# EAGLE design eagle (EAGLE 9.5.0)
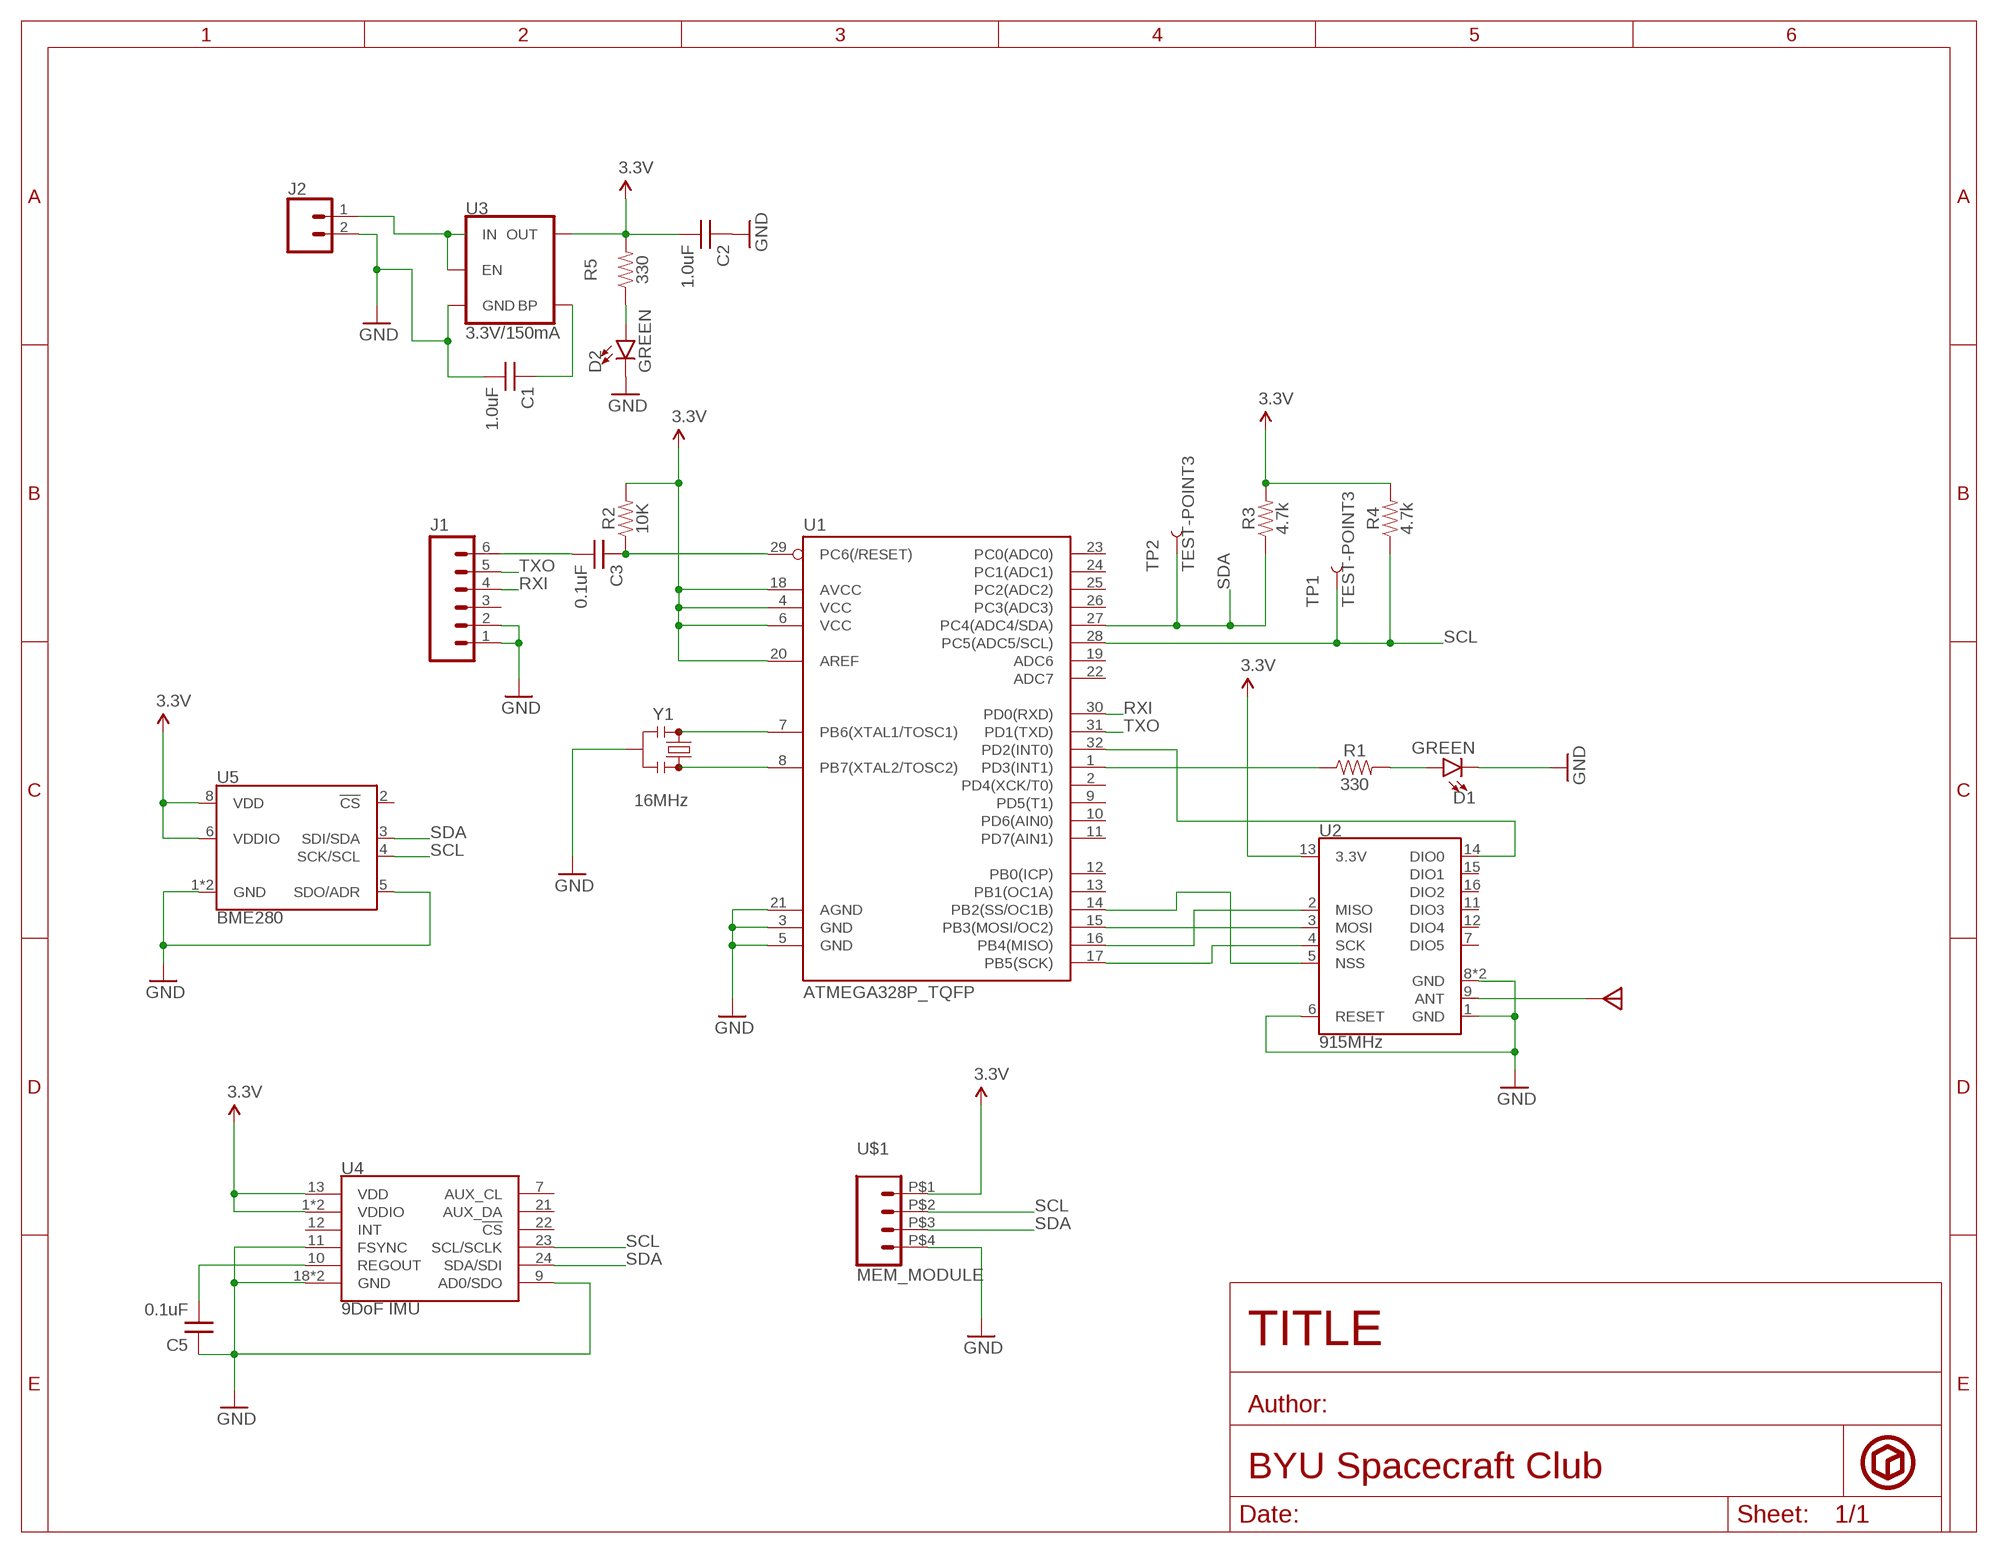
[diagram p0: schematic, sheet 1]

## Parts
ANT1  ANTENNA_PAD  [RFM12B-ANTENNA]
C1  1.0uF  CAPACITOR_1.0UF-0603-16V-10%  [0603]
C2  1.0uF  CAPACITOR_1.0UF-0603-16V-10%  [0603]
C3  0.1uF  CAPACITOR_0.1UF  [0603-CAP]
C5  0.1uF  CAPACITOR_0.1UF  [0603-CAP]
D1  GREEN  LED_GREEN0603  [LED-0603]
D2  GREEN  LED_GREEN0603  [LED-0603]
J1  CONNECTOR_6PINSILK_FEMALE_PTH  [1X06]
J2  CONNECTOR_2PIN-JST-2MM-SMT  [JST-2-SMD]
R1  330  RESISTOR_330OHM-0603-1/10W-1%  [0603]
R2  10K  RESISTOR_10KOHM0603  [0603-RES]
R3  4.7k  RESISTOR_4.7KOHM-0603-1/10W-1%  [0603]
R4  4.7k  RESISTOR_4.7KOHM-0603-1/10W-1%  [0603]
R5  330  RESISTOR_330OHM-0603-1/10W-1%  [0603]
TP1  TEST-POINT3  [PAD.03X.03]
TP2  TEST-POINT3  [PAD.03X.03]
U1  ATMEGA328P_TQFP  [TQFP32-08]
U2  915MHz  RADIO_RFM69HCW-915  [RFM69HCW-XXXS2]
U3  3.3V/150mA  VOLTAGE_REGULATOR_MIC52053.3V  [SOT23-5]
U4  9DoF IMU  MPU9250  [QFN24-3X3]
U5  BME280  [LGA-8-2.5X2.5]
U$1  MEM_MODULE  [MEM-HEADERS]
Y1  16MHz  RESONATOR_16MHZSMD_3.2X1.3  [RESONATOR-SMD-3.2X1.3]

## Nets
3.3V: C2.2 R2.2 R3.2 R4.2 R5.2 U1.4(VCC) U1.6(VCC) U1.18(AVCC) U1.20(AREF) U2.13(3.3V) U3.5(OUT) U4.1(VDDIO) U4.8(VDDIO) U4.13(VDD) U5.6(VDDIO) U5.8(VDD) U$1.P$1
GND: C1.2 C2.1 C5.1 D1.C D2.C J1.1 J1.2 J2.2 U1.3(GND) U1.5(GND) U1.21(AGND) U2.1(GND) U2.6(RESET) U2.8(GND) U2.10(GND) U3.2(GND) U4.9(AD0/SDO) U4.11(FSYNC) U4.18(GND) U4.20(GND) U5.1(GND) U5.5(SDO/ADR) U5.7(GND) U$1.P$4 Y1.2
INT: U1.32(PD2(INT0)) U2.14(DIO0)
N$1: U1.16(PB4(MISO)) U2.2(MISO)
N$2: U1.17(PB5(SCK)) U2.4(SCK)
N$3: U1.15(PB3(MOSI/OC2)) U2.3(MOSI)
N$4: J2.1 U3.1(IN) U3.3(EN)
N$5: ANT1.P$1 U2.9(ANT)
N$6: U1.14(PB2(SS/OC1B)) U2.5(NSS)
N$7: D2.A R5.1
N$9: C1.1 U3.4(BP)
N$10: U1.7(PB6(XTAL1/TOSC1)) Y1.1
N$11: U1.8(PB7(XTAL2/TOSC2)) Y1.3
N$12: D1.A R1.2
N$13: R1.1 U1.1(PD3(INT1))
N$14: C3.1 R2.1 U1.29(PC6(/RESET))
N$15: C3.2 J1.6
N$18: C5.2 U4.10(REGOUT)
RXI: J1.4 U1.30(PD0(RXD))
SCL: R4.1 TP1.P$1 U1.28(PC5(ADC5/SCL)) U4.23(SCL/SCLK) U5.4(SCK/SCL) U$1.P$2
SDA: R3.1 TP2.P$1 U1.27(PC4(ADC4/SDA)) U4.24(SDA/SDI) U5.3(SDI/SDA) U$1.P$3
TXO: J1.5 U1.31(PD1(TXD))
Unconnected: J1.3 U1.2(PD4(XCK/T0)) U1.9(PD5(T1)) U1.10(PD6(AIN0)) U1.11(PD7(AIN1)) U1.12(PB0(ICP)) U1.13(PB1(OC1A)) U1.19(ADC6) U1.22(ADC7) U1.23(PC0(ADC0)) U1.24(PC1(ADC1)) U1.25(PC2(ADC2)) U1.26(PC3(ADC3)) U2.7(DIO5) U2.11(DIO3) U2.12(DIO4) U2.15(DIO1) U2.16(DIO2) U4.7(AUX_CL) U4.12(INT) U4.21(AUX_DA) U4.22(!CS) U5.2(!CS)

## Library data of the parts
ANT1 = femtosat:ANTENNA_PAD: Pad for soldering on a wire antenna
C1 C2 = femtosat:CAPACITOR_1.0UF: 1µF ceramic capacitors A capacitor is a passive two-terminal electrical component used to store electrical energy temporarily in an electric field.; DIGIKEY: 399-3118-1-ND
C3 C5 = femtosat:CAPACITOR_0.1UF: CAP-00810 Ceramic Standard decoupling cap; DIGIKEY: 311-1343-1-ND
D1 D2 = femtosat:LED_GREEN: Green SMD LED Good as an indicator for power or to be controlled by a microcontroller Packages: 0603 - SMD 0603 package [Product Link] <https://www.digikey.com/product-detail/en/lite-on-inc/LTST-C190GKT/160-1183-1-ND/269255> Adapted fromt the SparkFun Libraries; DIGIKEY: 160-1183-1-ND
J1 = femtosat:CONNECTOR_6PIN: 6 pin connection point. Used on the femtosat for a programming connector. The ECEN shop stocks these regularly NOTES ON THE VARIANTS LOCK and LOCK_LONGPADS... This footprint was designed to help hold the alignment of a through-hole component (i.e. 6-pin header) while soldering it into place. You may notice that each hole has been shifted either up or down by 0.005 of an inch from it's more standard position (which is a perfectly straight line). This slight alteration caused the pins (the squares in the middle) to touch the edges of the holes. Because they are alternating, it causes a "brace" to hold the component in place. 0.005 has proven to be the perfect amount of "off-center" position when using our standard breakaway headers. Although looks a little odd when you look at the bare footprint, once you have a header in there, the alteration is very hard to notice. Also, if you push a header all the way into place, it is covered up entirely on the bottom side.
J2 = femtosat:CONNECTOR_2PIN: 2 pin connector 1X02 variant Can be used for soldering on wires or pins. JST-PTH variant is a through hole battery connector for SparkFun batteries JST-SMT variant is a surface mount battery connector for SparkFun batteries; DIGIKEY: 455-1749-1-ND
R1 R5 = femtosat:RESISTOR_330OHM: 330 Ohm resistor A resistor is a passive two-terminal electrical component that implements electrical resistance as a circuit element. Resistors act to reduce current flow, and, at the same time, act to lower voltage levels within circuits. - Wikipedia; DIGIKEY: 311-330GRCT-ND
R2 = femtosat:RESISTOR_10KOHM: 10k Ohm Resistor; DIGIKEY: 311-10KGRCT-ND
R3 R4 = femtosat:RESISTOR_4.7KOHM: 4.7k Ohm resistor A resistor is a passive two-terminal electrical component that implements electrical resistance as a circuit element. Resistors act to reduce current flow, and, at the same time, act to lower voltage levels within circuits. - Wikipedia; DIGIKEY: 311-4.7KGRCT-ND
TP1 TP2 = femtosat:TEST-POINT: Test Points Bare copper test points for troubleshooting or In-Circuit-Testing. These are used by our Production team for verifying production board runs using pogo-pins on test beds. Adapted from SparkFun Libraries
U1 = femtosat:ATMEGA328P_TQFP: ATMEGA 328P Microcontroller in QFP package Adapted from SparkFun libraries; DIGIKEY: ATMEGA328P-AURCT-ND
U2 = femtosat:RADIO_RFM69H: Hope RF RFM69H ISM Transceiver Module The RFM69H is a transceiver module capable of operation over a wide frequency range, including the 315,433,868 and 915MHz license-free ISM (Industry Scientific and Medical) frequency bands. All major RF communication parameters are programmable and most of them can be dynamically set. The RFM69H offers the unique advantage of programmable narrow-band and wide- band communication modes. The RFM69H is optimized for low power consumption while offering high RF output power and channelized operation.Compliance ETSI and FCC regulations. Datasheet <http://www.hoperf.cn/upload/docs/RF/SX/RFM69H_DataSheet_v1.3.pdf> Adapted from SparkFun Libraries; LINK: http://www.anarduino.com/details.jsp?pid=162
U3 = femtosat:VOLTAGE_REGULATOR_MIC5205: V_REG MIC5205 Standard 3.3V, 5V, and Adjustable 150mA LDO voltage regulator in SOT-23 layout. Micrel part MIC5205. BP (by-pass) pin is used to lower output noise with 470pF cap, may be left open. On the adjustable version BP is used to set output. Adapted from SparkFun Libraries; DIGIKEY: 576-1259-1-ND
U4 = femtosat:MPU9250: MPU-9250 9 Degree of Freedom IMU System in Package that contains MPU-6500 & AK8963 NC pin 19. 2-6 & 14-17 not internally connected. May be used for PCB trace routing. Datasheet <https://cdn.sparkfun.com/assets/learn_tutorials/5/5/0/MPU9250REV1.0.pdf> Adapted from SparkFun Libraries; DIGIKEY: 1428-1019-1-ND
U5 = femtosat:BME280: Bosch BME280 – Combined Humidity and Pressure Sensor The BME280 is as combined digital humidity, pressure and temperature sensor based on proven sensing principles. The sensor module is housed in an extremely compact metal-lid LGA package with a footprint of only 2.5×2.5mm² with a height of 0.93mm. Its small dimensions and its low power consumption allow the implementation in battery driven devices such as handsets, GPS modules or watches. Datasheet <https://cdn.sparkfun.com/assets/learn_tutorials/4/1/9/BST-BME280_DS001-10.pdf> Adapted from the SparkFun Libraries; DIGIKEY: 828-1063-1-ND
U$1 = femtosat:MEM_MODULE
Y1 = femtosat:RESONATOR_16MHZ: 16MHz Resonator Digikey Example <http://www.digikey.com/product-detail/en/murata-electronics-north-america/CSTCE16M0V53-R0/490-1198-1-ND/584635> Frequency: 16MHz Frequency Stability: ±0.3% Frequency Tolerance: ±0.5% Capacitance: 15pF Adapted from SparkFun Libraries; DIGIKEY: 490-1198-1-ND

## Board
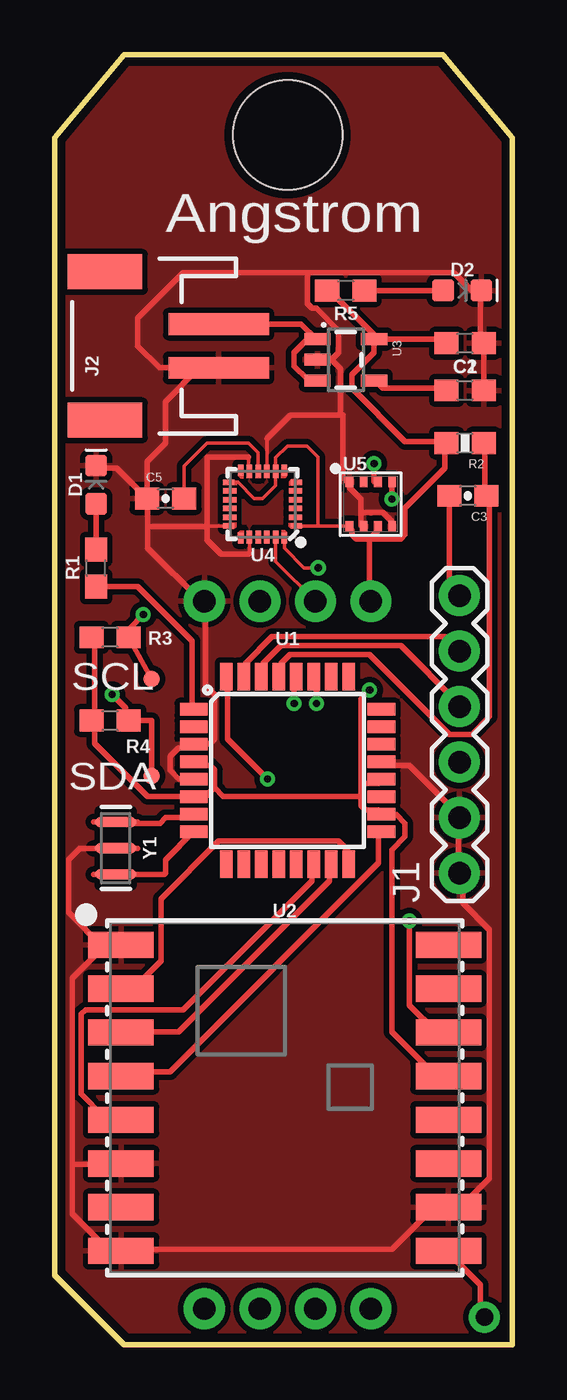
[diagram p1: board, top side]
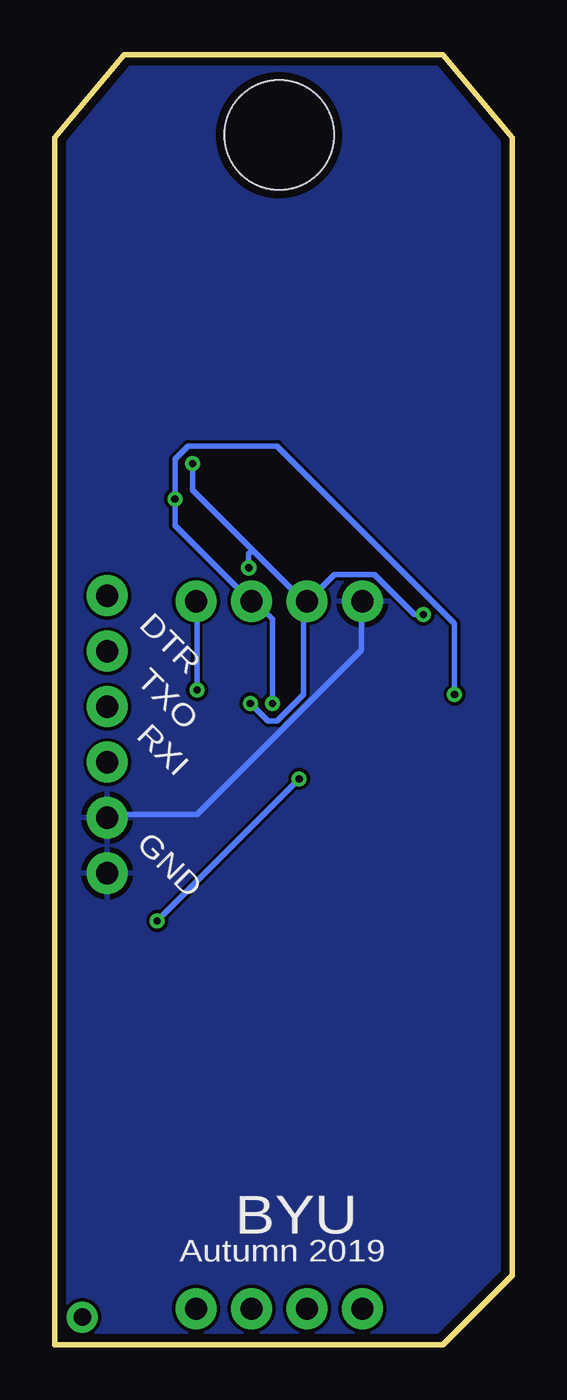
[diagram p2: board, bottom side, seen from below]

Size 20.95 x 59.05 mm. Coordinates in mm from the lower left corner, seen from the top.
Outline: 20.95,0 3.17,0 0,3.18 0,55.24 3.17,59.05 17.78,59.05 20.95,55.24 20.95,0
Copper layers (1*16): Top 0.0356mm / dielectric 1.5011mm / Bottom 0.0356mm
Design rules "femtosat *": minimum track width 10mil, minimum drill 13mil, track to track 6mil, track to pad 6mil, pad to pad 6mil, via to via 6mil, smd to smd 6mil, copper to edge 15mil, drill to drill 6mil, minimum pad ring 7mil, minimum via ring 7mil, stop-mask expansion 2.5mil, vias tented up to drill 0mil, thermal gap 10mil
Holes 5 mm at 10.67,55.37

### Footprints (pad centres in the part's own frame; a part is rotated, then mirrored left to right if it is on the bottom)
RFM12B-ANTENNA = drill 0.8 pad 1.422: P$1 0,0
0603 = smd 1.1 x 1: 1 -0.85,0; 2 0.85,0
0603-CAP = smd 1.1 x 1: 1 -0.85,0; 2 0.85,0
LED-0603 = smd 1 x 1: A -0.877,0; C 0.877,0
1X06 = drill 1.016 pad 1.88: 1 -6.35,0; 2 -3.81,0; 3 -1.27,0; 4 1.27,0; 5 3.81,0; 6 6.35,0
JST-2-SMD = smd 1 x 4.6: 1 1,-3.7; 2 -1,-3.7 | smd 1.6 x 3.4: NC1 -3.4,1.5; NC2 3.4,1.5
0603-RES = smd 1.1 x 1: 1 -0.85,0; 2 0.85,0
PAD.03X.03 = smd 0.762 x 0.762: P$1 0,0
TQFP32-08 = smd 1.27 x 0.559: 1 -4.293,2.8; 2 -4.293,2; 3 -4.293,1.2; 4 -4.293,0.4; 5 -4.293,-0.4; 6 -4.293,-1.2; 7 -4.293,-2; 8 -4.293,-2.8; 17 4.293,-2.8; 18 4.293,-2; 19 4.293,-1.2; 20 4.293,-0.4; 21 4.293,0.4; 22 4.293,1.2; 23 4.293,2; 24 4.293,2.8 | smd 0.559 x 1.27: 9 -2.8,-4.293; 10 -2,-4.293; 11 -1.2,-4.293; 12 -0.4,-4.293; 13 0.4,-4.293; 14 1.2,-4.293; 15 2,-4.293; 16 2.8,-4.293; 25 2.8,4.293; 26 2,4.293; 27 1.2,4.293; 28 0.4,4.293; 29 -0.4,4.293; 30 -1.2,4.293; 31 -2,4.293; 32 -2.8,4.293
RFM69HCW-XXXS2 = smd 3 x 1.2: 1 -7.5,7; 2 -7.5,5; 3 -7.5,3; 4 -7.5,1; 5 -7.5,-1; 6 -7.5,-3; 7 -7.5,-5; 8 -7.5,-7; 9 7.5,-7; 10 7.5,-5; 11 7.5,-3; 12 7.5,-1; 13 7.5,1; 14 7.5,3; 15 7.5,5; 16 7.5,7
SOT23-5 = smd 0.55 x 1.2: 1 -0.95,-1.3; 2 0,-1.3; 3 0.95,-1.3; 4 0.95,1.3; 5 -0.95,1.3
QFN24-3X3 = smd 0.495 x 0.25: 1 -1.552,1; 6 -1.552,-1; 13 1.552,-1; 18 1.552,1 | smd 0.6 x 0.25: 2 -1.5,0.6; 3 -1.5,0.2; 4 -1.5,-0.2; 5 -1.5,-0.6; 14 1.5,-0.6; 15 1.5,-0.2; 16 1.5,0.2; 17 1.5,0.6 | smd 0.25 x 0.495: 7 -1,-1.552; 12 1,-1.552; 19 1,1.552; 24 -1,1.552 | smd 0.25 x 0.6: 8 -0.6,-1.5; 9 -0.2,-1.5; 10 0.2,-1.5; 11 0.6,-1.5; 20 0.6,1.5; 21 0.2,1.5; 22 -0.2,1.5; 23 -0.6,1.5
LGA-8-2.5X2.5 = smd 0.35 x 0.5: 1 -0.975,1.025; 2 -0.325,1.025; 3 0.325,1.025; 4 0.975,1.025; 5 0.975,-1.025; 6 0.325,-1.025; 7 -0.325,-1.025; 8 -0.975,-1.025
MEM-HEADERS = drill 1.016 pad 1.88: P$1 0,0; P$2 2.54,0; P$3 5.08,0; P$4 7.62,0; P$5 0,32.385; P$6 2.54,32.385; P$7 5.08,32.385; P$8 7.62,32.385
RESONATOR-SMD-3.2X1.3 = smd 0.45 x 1.905: 1 -1.2,0; 2 0,0; 3 1.2,0

### Placement (x,y rotation side)
ANT1  19.68,1.27 0 top
C1  18.8,43.69 0 top
C2  18.8,45.85 180 top
C3  18.92,38.86 180 top
C5  5.08,38.73 0 top
D1  1.91,39.37 90 top
D2  18.67,48.26 0 top
J1  18.54,27.94 90 top
J2  3.81,45.72 90 top
R1  1.91,35.56 90 top
R2  18.8,41.28 180 top
R3  2.54,32.39 180 top
R4  2.54,28.57 180 top
R5  13.34,48.26 180 top
TP1  4.45,26.04 0 top
TP2  4.45,30.48 0 top
U1  10.67,26.29 0 top
U2  10.54,11.3 0 top
U3  13.34,45.08 270 top
U4  9.53,38.48 180 top
U5  14.48,38.48 0 top
U$1  14.48,34.04 180 top
Y1  2.79,22.73 270 top

### Tracks (layer width: path | path; a pad name or v marks a point on that pad's centre or on a via)
3.3V  (via drill 0.33)
  Top 0.152: U4.1 12.06,37.48 | 12.06,37.48 13.48,37.48 | U4.13 8.4,39.48 9.14,38.73 9.53,38.73 10.12,39.33 U4.8 10.12,40.61 10.67,41.15 11.56,41.15 12.06,40.64 12.06,37.48
  Top 0.254: R5.2 12.6,48.26 14.63,46.23 U3.5 | C2.2 17.88,46.03 14.83,46.03 U3.5 | 14.43,36.88 13.82,36.88 13.61,37.08 13.61,37.29 U5.8 13.48,37.48 | 14.43,36.88 14.83,37.29 U5.6 | 14.43,36.88 14.43,34.04 U$1.P$1 | 14.43,36.88 15.85,36.88 16.05,37.08 16.05,38.3 17.88,40.13 17.88,41.15 R2.2 17.88,41.35 16.05,41.35 13.61,43.79 13.61,44.4 14.63,45.42 U3.5 | 14.02,25.5 14.02,25.1 | 14.02,25.1 14.02,24.69 14.22,24.49 14.83,24.49 U1.18 15.04,24.28 15.65,24.28 16.05,23.88 16.05,23.27 15.44,22.66 15.44,14.33 17.27,12.5 17.88,12.5 U2.13 | 14.02,25.5 14.22,25.71 14.83,25.71 U1.20 | 7.32,25.5 6.91,25.1 6.5,25.1 U1.6 6.3,25.1 4.27,25.1 1.83,27.53 1.83,28.55 R4.2 1.83,28.75 1.83,32.21 R3.2 | 7.32,25.5 7.32,26.31 7.11,26.52 6.5,26.52 U1.4 | 14.02,25.1 7.72,25.1 7.32,25.5 | v14.43,29.97 14.02,29.57 14.02,25.5
  Bottom 0.254: v14.43,29.97 14.43,34.04 U$1.P$1
GND
  Top 0.152: U4.20 8.93,36.23 | U4.9 9.72,41.47 | U4.18 7,37.48 | U4.11 8.89,40.02 8.89,40.64
  Top 0.254: D1.C 2.03,40.13 2.85,40.13 4.06,38.91 C5.1 | U1.5 6.3,25.91 5.69,25.91 5.28,26.31 5.28,26.92 5.69,27.33 6.3,27.33 U1.3 6.5,27.53 7.11,27.53 7.32,27.74 7.32,29.77 6.91,30.18 6.91,34.04 U$1.P$4 6.71,34.04 4.27,36.47 4.27,37.47 | 4.27,37.47 4.27,38.71 C5.1 | 14.02,38.1 14.02,38.71 13.5,39.23 U5.1 13.41,39.52 13.21,39.73 13.21,42.55 13.08,42.55 | 14.02,38.1 14.02,37.49 U5.7 | 14.02,38.1 15.04,38.1 15.44,37.69 15.44,37.49 U5.5 | 19.51,48.26 19.51,46.03 C2.1 C1.2 | 19.51,48.26 19.1,48.26 18.29,49.07 11.58,49.07 | 11.58,49.07 5.89,49.07 3.81,46.99 3.81,45.72 4.81,44.72 J2.2 6.62,44.72 5.08,43.18 5.08,41.28 4.23,40.42 C5.1 | 19.51,48.26 D2.C | 11.58,49.07 11.58,47.65 11.79,47.45 11.99,47.45 13.01,46.43 13.01,45.42 12.68,45.08 | U1.21 15.04,26.52 16.26,26.52 18.49,24.28 J1.2 18.49,24.08 18.49,21.64 J1.1 18.69,21.44 18.69,20.22 19.91,19 19.91,7.62 18.69,6.4 18.09,6.4 U2.10 17.88,6.2 17.27,6.2 15.44,4.37 3.05,4.37 U2.8 2.85,4.37 2.44,4.37 0.81,5.99 0.81,8.25 | 2.23,18.19 2.85,18.19 U2.1 | 2.23,18.19 0.81,16.76 0.81,8.25 | 8.89,40.64 6.99,40.64 6.99,37.47 | 6.99,37.47 6.99,36.83 7.62,36.2 8.89,36.2 8.93,36.23 | Y1.2 1.14,22.73 0.64,22.22 0.64,19.79 2.23,18.19 | U2.6 2.99,8.25 0.81,8.25 | 9.72,41.47 10.79,42.55 13.08,42.55 | 12.68,45.08 U3.2 | 12.68,45.08 13.08,44.68 13.08,42.55 | 7,37.48 6.99,37.47 | 6.99,37.47 4.27,37.47
  Bottom 0.254: U$1.P$4 6.91,34.04 6.91,31.8 14.43,24.28 18.49,24.28 J1.2
  pour Top (isolate 0.254): 0,3.18 0,55.24 3.17,59.05 17.78,59.05 20.95,55.24 20.95,0 3.17,0
  pour Bottom: 3.17,59.05 0,55.24 0,3.18 3.17,0 20.95,0 20.95,55.24 17.78,59.05
INT  (via drill 0.33)
  Top 0.254: v9.75,25.91 7.92,27.74 7.92,30.58 U1.32 | v16.26,19.41 16.26,15.55 17.48,14.33 17.88,14.33 U2.14
  Bottom 0.254: v16.26,19.41 v9.75,25.91
N$1
  Top 0.254: U1.16 13.41,22.05 13.41,22.66 13.01,23.06 7.52,23.06 4.88,20.42 4.88,17.58 3.66,16.36 3.05,16.36 U2.2
N$2
  Top 0.254: U1.17 14.83,23.47 14.83,22.05 5.28,12.5 3.05,12.5 U2.4
N$3
  Top 0.254: U1.15 12.6,21.84 12.6,21.23 5.69,14.33 3.05,14.33 U2.3
N$4
  Top 0.254: 11.99,46.03 11.58,46.03 10.97,45.42 10.97,44.81 11.58,44.2 11.99,44.2 U3.3 | 11.99,46.03 U3.1 | J2.1 11.29,46.72 11.99,46.03
N$5
  Top 0.254: ANT1.P$1 19.51,1.32 19.51,2.74 18.09,4.17 U2.9
N$6
  Top 0.254: U1.14 11.79,21.84 11.79,21.23 5.89,15.34 1.42,15.34 1.22,15.14 1.22,11.48 2.23,10.46 2.85,10.46 U2.5
N$7
  Top 0.254: R5.1 D2.A
N$9
  Top 0.254: C1.1 17.88,43.79 15.04,43.79 14.83,43.99 U3.4
N$10
  Top 0.254: U1.7 6.22,24.13 5.08,24.13 4.83,23.88 2.85,23.88 Y1.1
N$11
  Top 0.254: U1.8 5.08,22.19 5.08,21.59 5.02,21.53 Y1.3
N$12
  Top 0.254: 1.83,38.3 D1.A 1.91,36.53 1.83,36.45 R1.2
N$13
  Top 0.254: U1.1 6.3,29.16 6.3,32.21 3.8,34.71 R1.1
N$14
  Top 0.254: R2.1 19.71,41.15 19.71,38.91 C3.1 19.91,38.71 19.91,28.75 19.1,27.94 18.09,27.94 14.43,31.6 10.77,31.6 10.36,31.19 10.36,30.58 U1.29
N$15
  Top 0.254: C3.2 18.09,38.71 18.09,34.85 18.49,34.44 J1.6
N$18
  Top 0.152: U4.10 9.32,40.84 8.89,41.28 6.99,41.28 5.93,40.22 C5.2
RXI
  Top 0.254: U1.30 9.55,30.58 9.55,31.19 10.36,32 15.85,32 18.49,29.36 J1.4
SCL  (via drill 0.33)
  Top 0.152: U4.23 10.12,35.85 U$1.P$2
  Top 0.254: v15.44,38.71 15.44,39.32 U5.4 | v10.97,29.36 10.97,30.58 U1.28 | v2.64,29.77 3.25,29.16 3.25,28.75 R4.1 4.45,28.57 TP1.P$1
  Bottom 0.254: v10.97,29.36 10.97,33.22 11.79,34.04 U$1.P$2 11.99,34.04 15.44,37.49 v15.44,38.71 15.44,40.54 14.83,41.15 10.77,41.15 2.64,33.02 v2.64,29.77
SDA  (via drill 0.33, 0.35)
  Top 0.152: U4.24 10.53,36.47 11.43,35.56 v12.06,35.56
  Top 0.254: v14.63,40.33 14.63,39.52 U5.3 | v11.99,29.36 11.99,30.58 U1.27 | v4.06,33.43 3.45,32.82 3.45,32.41 R3.1 TP2.P$1
  Bottom 0.254: v14.63,40.33 14.63,39.12 11.89,36.37 | 9.55,34.04 11.89,36.37 | v11.99,29.36 11.18,28.55 10.77,28.55 9.55,29.77 9.55,34.04 | 9.55,34.04 U$1.P$3 9.35,34.04 8.13,35.25 6.3,35.25 4.47,33.43 v4.06,33.43 | v12.06,35.56 12.06,36.2 11.89,36.37
TXO
  Top 0.254: J1.5 17.88,32.41 9.96,32.41 8.74,31.19 8.74,30.58 U1.31

### Text on the board
tPlace: Angstrom | SCL | SDA
bPlace: DTR | TXO | RXI | GND | BYU | Autumn 2019